# EAGLE design LM2735 (EAGLE 7.6.0)
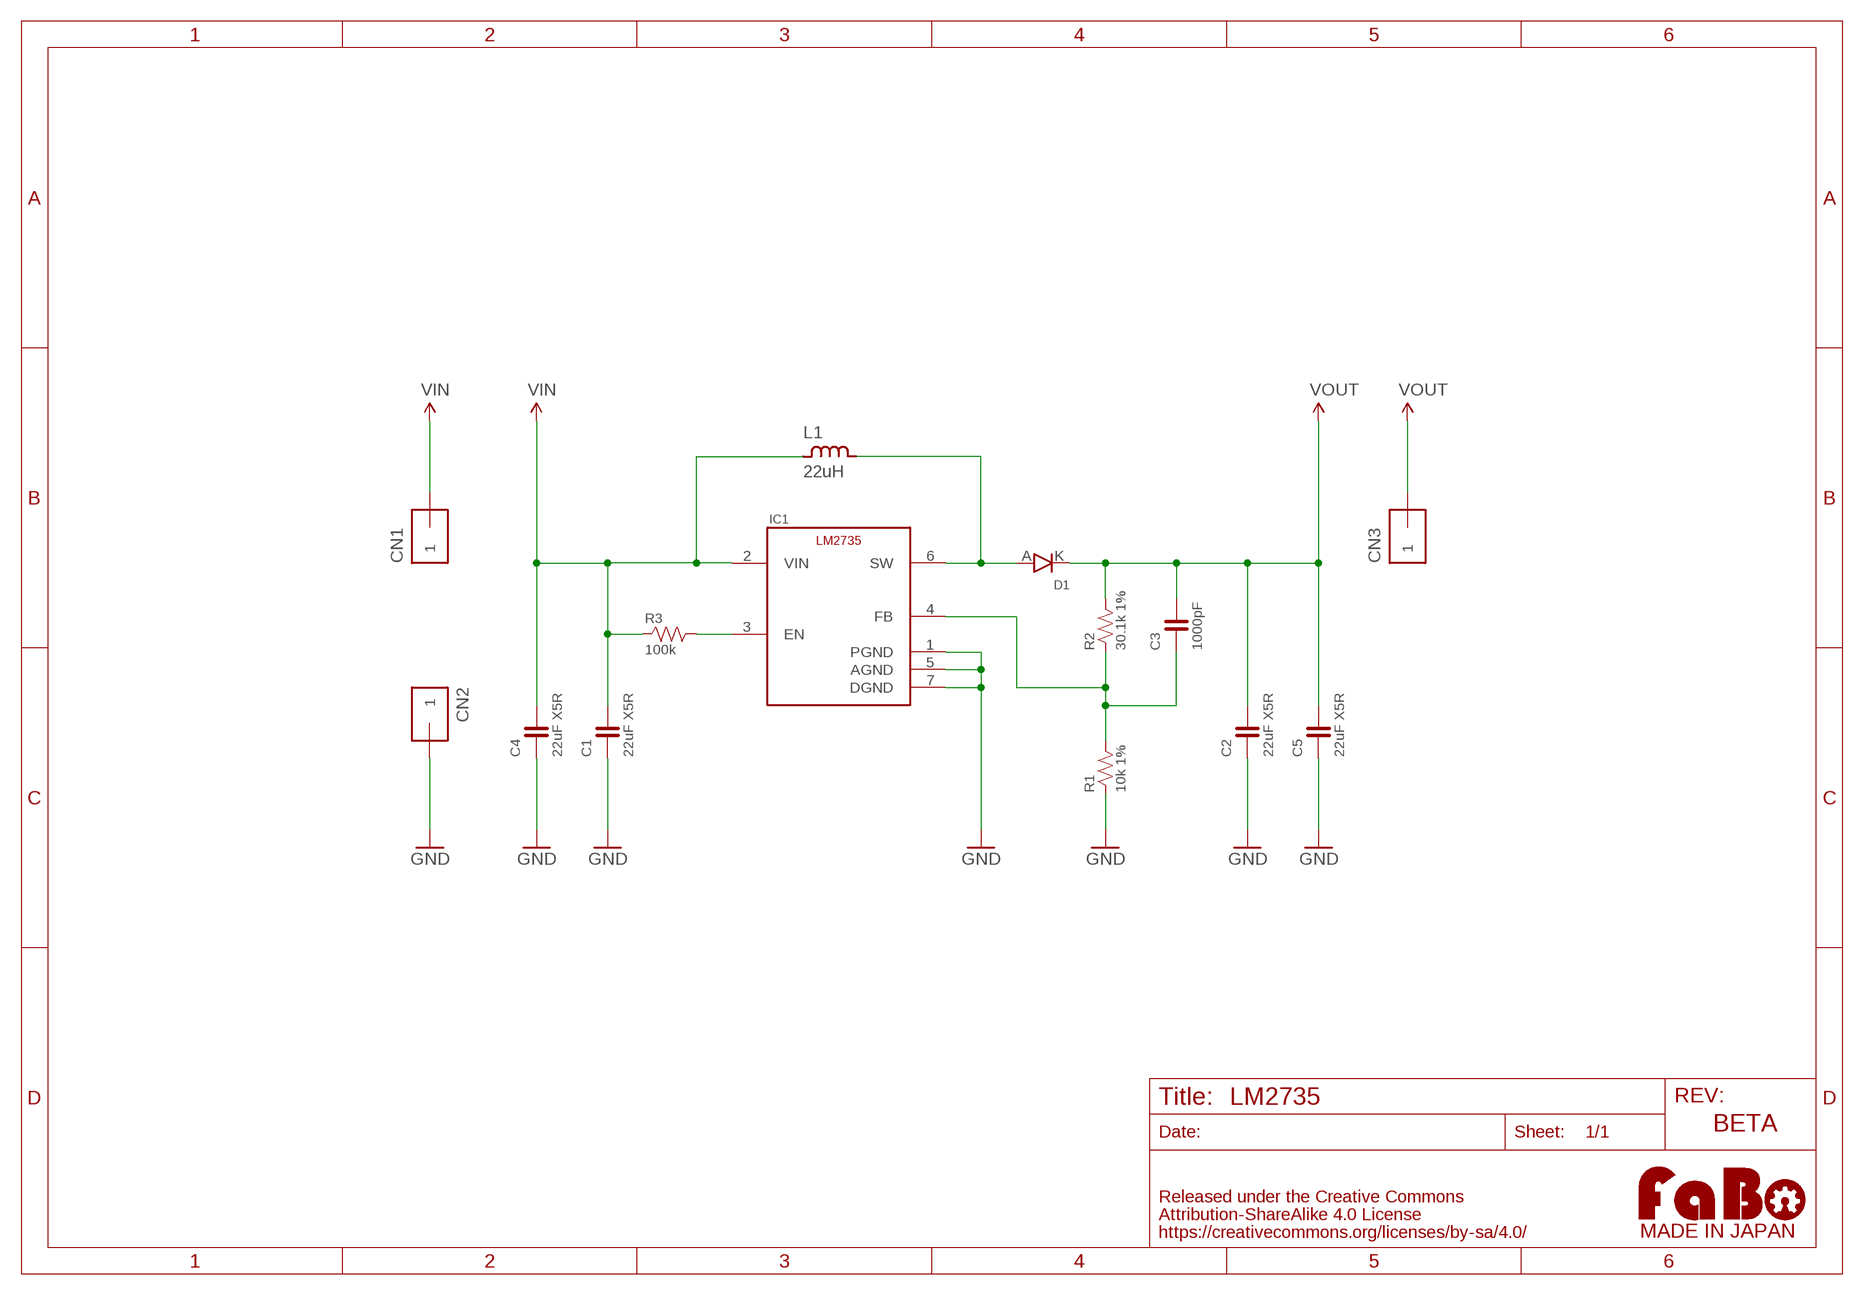
[diagram p0: schematic, sheet 1]

## Parts
C1  22uF X5R  CAPACITOR-0603_NARROW  [0603-NARROW]
C2  22uF X5R  CAPACITOR-0603_NARROW  [0603-NARROW]
C3  1000pF  CAPACITOR-0603_NARROW  [0603-NARROW]
C4  22uF X5R  CAPACITOR-0603_NARROW  [0603-NARROW]
C5  22uF X5R  CAPACITOR-0603_NARROW  [0603-NARROW]
CN1  PIN_HEADER_1X1-SMALL  [PIN_1X1_SMALL]
CN2  PIN_HEADER_1X1-SMALL  [PIN_1X1_SMALL]
CN3  PIN_HEADER_1X1-SMALL  [PIN_1X1_SMALL]
D1  DIODE-STPS120M  [ST-MITE]
IC1  LM2735YQSDX  [WSON-6]
L1  22uH  INDUCTOR-NR5040  [NR5040]
R1  10k 1%  RESISTOR-0603-NARROW  [0603-NARROW]
R2  30.1k 1%  RESISTOR-0603-NARROW  [0603-NARROW]
R3  100k  RESISTOR-0603-NARROW  [0603-NARROW]
U$2  LOGO_FABO-M_BOTTOM  [LOGO_FABO_MS_BOTTOM]

## Nets
FB: C3.1 IC1.4(FB) R1.2 R2.1
GND: C1.1 C2.1 C4.1 C5.1 CN2.1 IC1.1(PGND) IC1.5(AGND) IC1.7(DGND) R1.1
N$5: IC1.3(EN) R3.2
SW: D1.A IC1.6(SW) L1.2
VIN: C1.2 C4.2 CN1.1 IC1.2(VIN) L1.1 R3.1
VOUT: C2.2 C3.2 C5.2 CN3.1 D1.K R2.2

## Notes on the sheet
- BETA

## Library data of the parts
C1-C5 = FaBo-Capacitor:CAPACITOR: CAPACITOR
CN1-CN3 = FaBo-PIN:PIN_HEADER_1X1
D1 = FaBo-Parts:DIODE
IC1 = FaBo-Supply:LM2735
L1 = FaBo-Parts:INDUCTOR
R1-R3 = FaBo-Resistors:RESISTOR: RESISTOR
U$2 = FaBo-Logo:LOGO_FABO

## Board
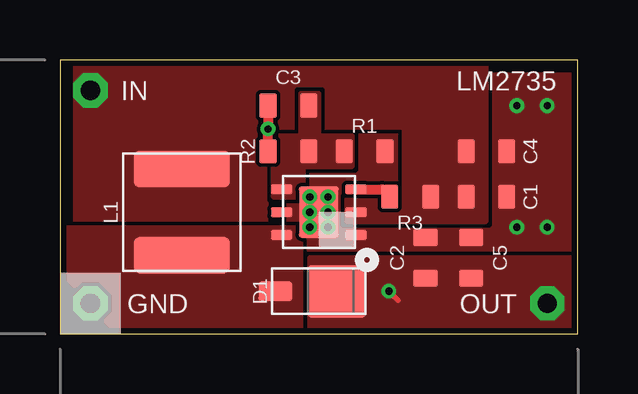
[diagram p1: board, top side]
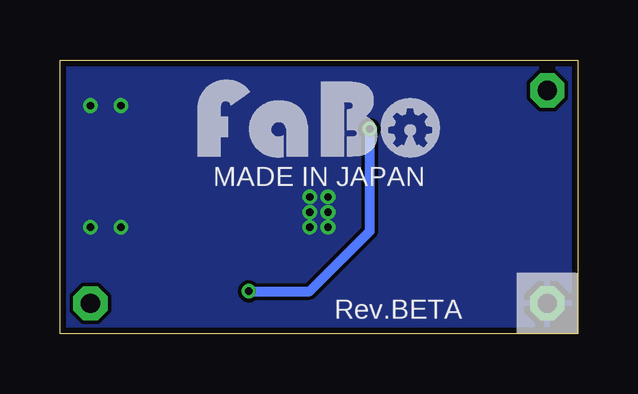
[diagram p2: board, bottom side, seen from below]

Size 21.59 x 11.43 mm. Coordinates in mm from the lower left corner, seen from the top.
Outline: 0,0 21.59,0 21.59,11.43 0,11.43 0,0
Copper layers (1*16): Top 0.035mm / dielectric 1.5mm / Bottom 0.035mm
Design rules "Elecrow_angle": minimum track width 6mil, minimum drill 12mil, track to track 6mil, track to pad 6mil, pad to pad 6mil, via to via 6mil, smd to smd 0mil, copper to edge 10mil, drill to drill 10mil, minimum pad ring 10mil, minimum via ring 6mil, stop-mask expansion 2mil, vias tented up to drill 100mil, thermal gap 10mil

### Footprints (pad centres in the part's own frame; a part is rotated, then mirrored left to right if it is on the bottom)
0603-NARROW = smd 0.71 x 1: 1 -0.85,0; 2 0.85,0
PIN_1X1_SMALL = drill 0.8 pad 1.422 octagon: 1 0,0
ST-MITE = smd 1.4 x 0.8: A 1.81,0 | smd 2.5 x 2.2: K -0.75,0
WSON-6 = smd 0.4 x 0.9: 1 -0.95,-1.55; 2 0,-1.55; 3 0.95,-1.55; 4 0.95,1.55; 5 0,1.55; 6 -0.95,1.55 | smd 2.15 x 1.65: 7 0,0
NR5040 = smd 1.5 x 4: 1 -1.8,0; 2 1.8,0

### Placement (x,y rotation side)
C1  17.78,5.71 180 top
C2  15.24,3.17 270 top
C3  9.53,9.53 180 top
C4  17.78,7.62 180 top
C5  17.14,3.17 270 top
CN1  1.27,10.16 0 top
CN2  1.27,1.27 0 top
CN3  20.32,1.27 0 top
D1  10.79,1.78 180 top
IC1  10.79,5.08 90 top
L1  5.08,5.08 270 top
R1  12.7,7.62 180 top
R2  9.53,7.62 180 top
R3  14.61,5.71 180 top
U$2  10.79,6.99 0 top

### Tracks (layer width: path | path; a pad name or v marks a point on that pad's centre or on a via)
FB
  pour Top (no thermals): 8.89,5.71 10.16,5.71 10.16,6.99 12.19,6.99 12.19,8.26 10.79,8.26 10.79,10.03 10.03,10.03 10.03,8.26 9.14,8.26 9.14,6.99 8.89,6.99
GND  (via drill 0.3)
  other vias: 10.41,5.08 10.41,5.71 10.41,4.45 11.18,4.45 11.18,5.08 11.18,5.71 20.32,4.45 20.32,9.53 19.05,4.45 19.05,9.53
  pour Bottom (rank 5): 0,11.43 21.59,11.43 21.59,0 0,0
  pour Top (rank 3, no thermals): 9.53,3.17 21.59,3.17 21.59,10.79 9.53,10.79
N$5
  Top 0.203: 13.44,6.03 R3.2
  Top 0.406: IC1.3 13.44,6.03
SW
  pour Top (no thermals): 0,4.45 10.03,4.45 10.03,0 2.41,0 0,2.67
VIN
  pour Top (rank 2, no thermals): 11.94,4.7 17.78,4.7 17.78,11.43 0.64,11.43 0.64,4.45 8.89,4.45 8.89,8.64 14.35,8.64 14.35,5.59 11.94,5.59
VOUT  (via drill 0.3)
  Top 0.203: v13.72,1.78 14.1,1.4
  Top 0.406: C3.2 v8.68,8.55 R2.2
  Bottom 0.406: v13.72,1.78 11.18,1.78 8.68,4.28 v8.68,8.55
  pour Top (rank 2, no thermals): 10.41,0 21.59,0 21.59,3.17 10.41,3.17

### Text on the board
tPlace: IN | LM2735 | GND | OUT
bPlace: MADE IN JAPAN | Rev.BETA